# EAGLE design A607B (EAGLE 6.6.0)
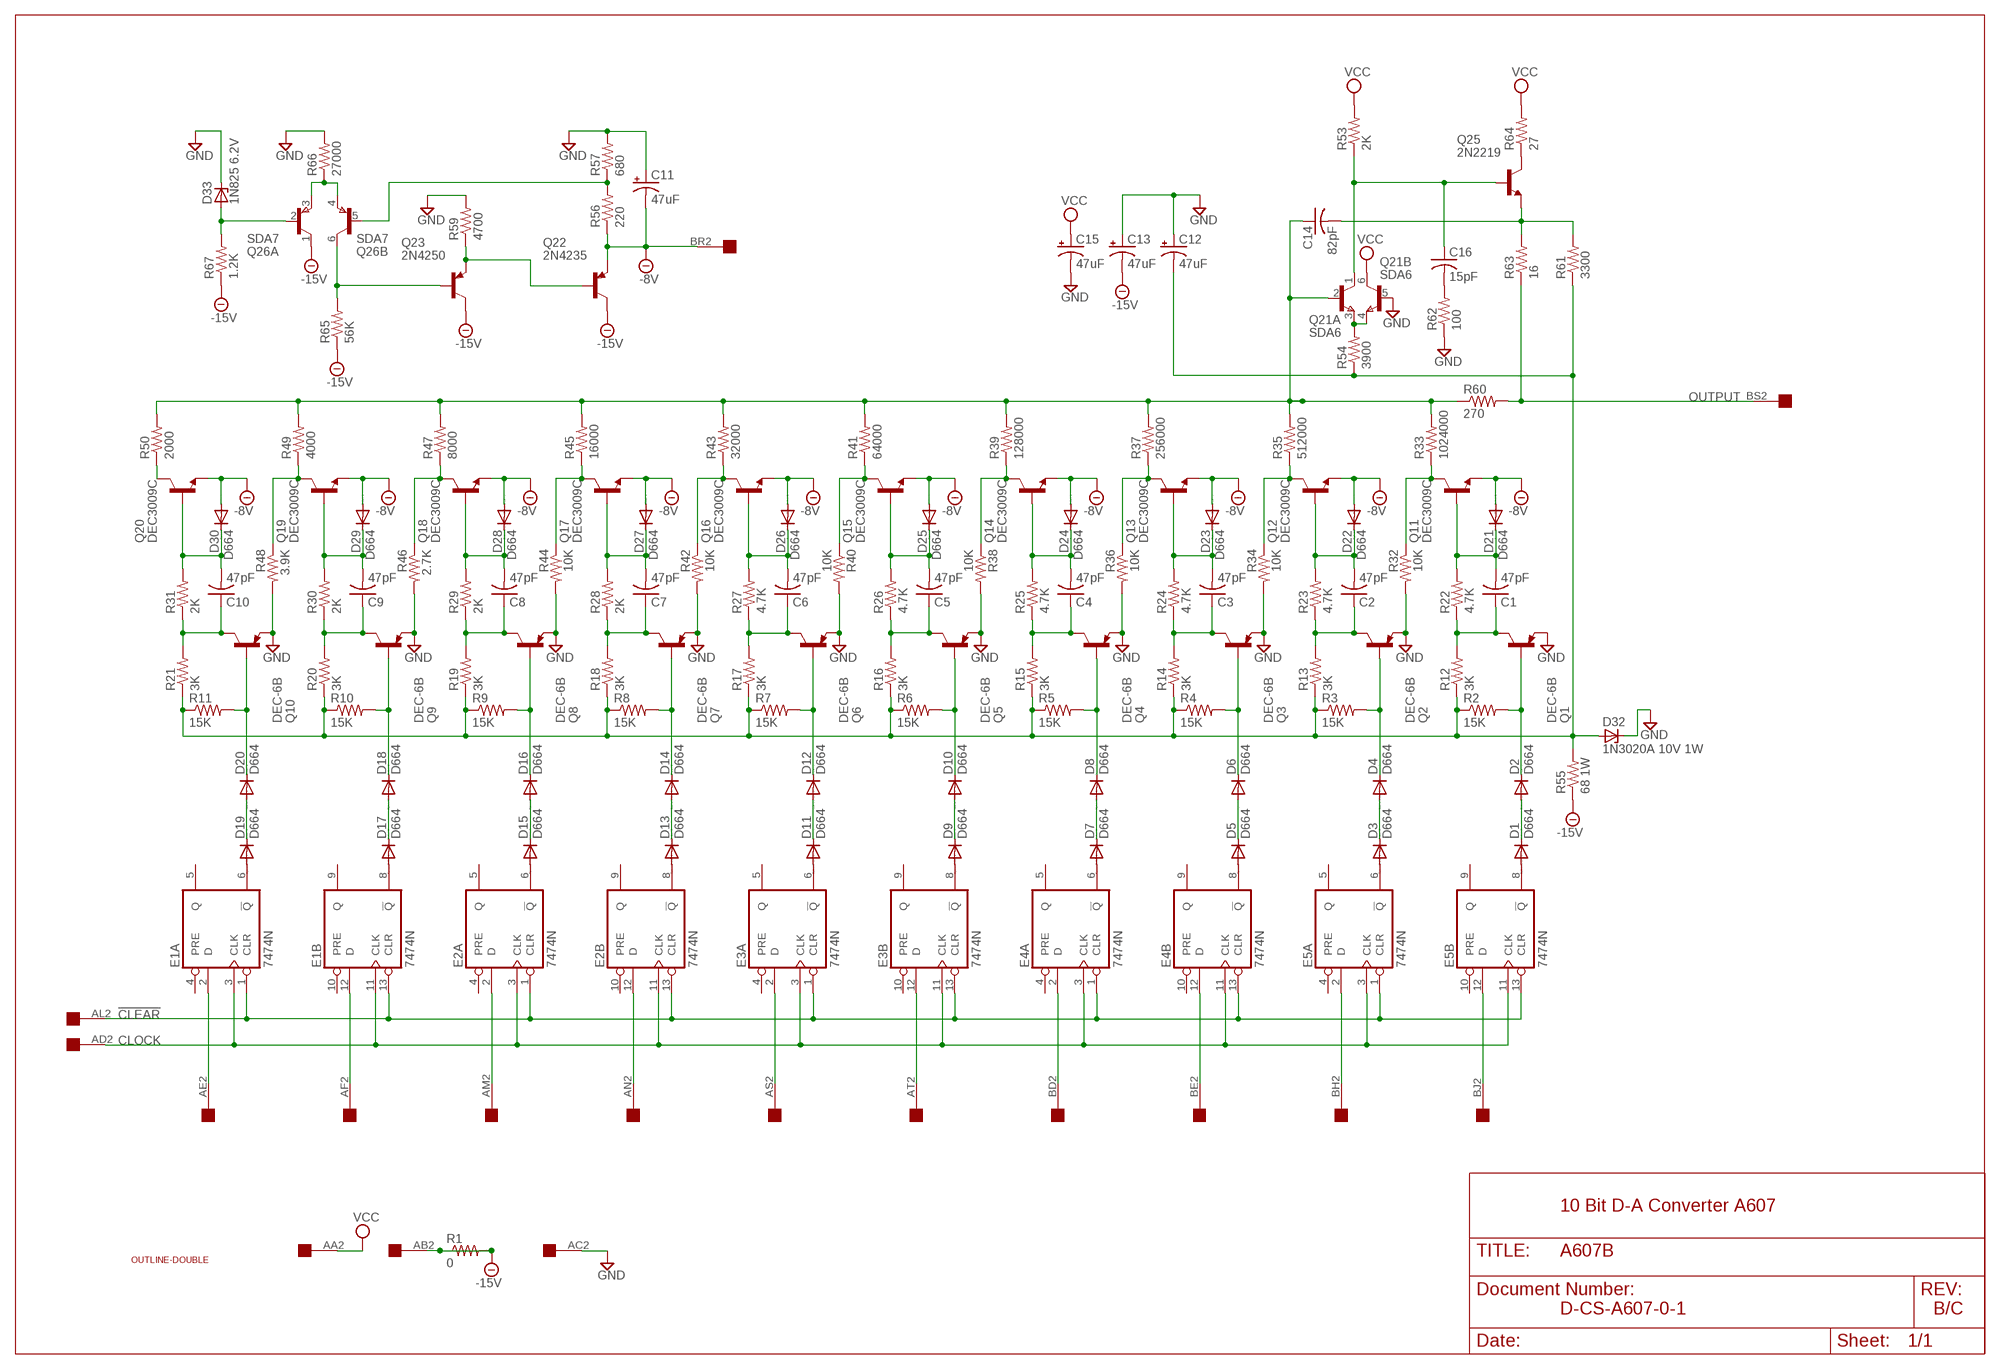
[diagram p0: schematic, sheet 1]

## Parts
C1  47pF  C-US075-032X103  [C075-032X103]
C2  47pF  C-US075-032X103  [C075-032X103]
C3  47pF  C-US075-032X103  [C075-032X103]
C4  47pF  C-US075-032X103  [C075-032X103]
C5  47pF  C-US075-032X103  [C075-032X103]
C6  47pF  C-US075-032X103  [C075-032X103]
C7  47pF  C-US075-032X103  [C075-032X103]
C8  47pF  C-US075-032X103  [C075-032X103]
C9  47pF  C-US075-032X103  [C075-032X103]
C10  47pF  C-US075-032X103  [C075-032X103]
C11  47uF  CPOL-USE25-9AXIAL  [E25-9]
C12  47uF  CPOL-USE25-9AXIAL  [E25-9]
C13  47uF  CPOL-USE25-9AXIAL  [E25-9]
C14  82pF  C-US050-025X075  [C050-025X075]
C15  47uF  CPOL-USE25-9AXIAL  [E25-9]
C16  15pF  C-US050-025X075  [C050-025X075]
D1  D664  DIODE-DO35-10  [DO35-10]
D2  D664  DIODE-DO35-10  [DO35-10]
D3  D664  DIODE-DO35-10  [DO35-10]
D4  D664  DIODE-DO35-10  [DO35-10]
D5  D664  DIODE-DO35-10  [DO35-10]
D6  D664  DIODE-DO35-10  [DO35-10]
D7  D664  DIODE-DO35-10  [DO35-10]
D8  D664  DIODE-DO35-10  [DO35-10]
D9  D664  DIODE-DO35-10  [DO35-10]
D10  D664  DIODE-DO35-10  [DO35-10]
D11  D664  DIODE-DO35-10  [DO35-10]
D12  D664  DIODE-DO35-10  [DO35-10]
D13  D664  DIODE-DO35-10  [DO35-10]
D14  D664  DIODE-DO35-10  [DO35-10]
D15  D664  DIODE-DO35-10  [DO35-10]
D16  D664  DIODE-DO35-10  [DO35-10]
D17  D664  DIODE-DO35-10  [DO35-10]
D18  D664  DIODE-DO35-10  [DO35-10]
D19  D664  DIODE-DO35-10  [DO35-10]
D20  D664  DIODE-DO35-10  [DO35-10]
D21  D664  DIODE-DO35-10  [DO35-10]
D22  D664  DIODE-DO35-10  [DO35-10]
D23  D664  DIODE-DO35-10  [DO35-10]
D24  D664  DIODE-DO35-10  [DO35-10]
D25  D664  DIODE-DO35-10  [DO35-10]
D26  D664  DIODE-DO35-10  [DO35-10]
D27  D664  DIODE-DO35-10  [DO35-10]
D28  D664  DIODE-DO35-10  [DO35-10]
D29  D664  DIODE-DO35-10  [DO35-10]
D30  D664  DIODE-DO35-10  [DO35-10]
D32  1N3020A 10V 1W  ZENER-DIODEDO13M  [DO13M]
D33  1N825 6.2V  ZENER-DIODEDO35Z10  [DO35Z10]
E1  7474N  74S74N  [DIL14]
E2  7474N  74S74N  [DIL14]
E3  7474N  74S74N  [DIL14]
E4  7474N  74S74N  [DIL14]
E5  7474N  74S74N  [DIL14]
Q1  DEC-6B  -PNP-TO5  [TO5]
Q2  DEC-6B  -PNP-TO5  [TO5]
Q3  DEC-6B  -PNP-TO5  [TO5]
Q4  DEC-6B  -PNP-TO5  [TO5]
Q5  DEC-6B  -PNP-TO5  [TO5]
Q6  DEC-6B  -PNP-TO5  [TO5]
Q7  DEC-6B  -PNP-TO5  [TO5]
Q8  DEC-6B  -PNP-TO5  [TO5]
Q9  DEC-6B  -PNP-TO5  [TO5]
Q10  DEC-6B  -PNP-TO5  [TO5]
Q11  DEC3009C  -NPN-TO5  [TO5]
Q12  DEC3009C  -NPN-TO5  [TO5]
Q13  DEC3009C  -NPN-TO5  [TO5]
Q14  DEC3009C  -NPN-TO5  [TO5]
Q15  DEC3009C  -NPN-TO5  [TO5]
Q16  DEC3009C  -NPN-TO5  [TO5]
Q17  DEC3009C  -NPN-TO5  [TO5]
Q18  DEC3009C  -NPN-TO5  [TO5]
Q19  DEC3009C  -NPN-TO5  [TO5]
Q20  DEC3009C  -NPN-TO5  [TO5]
Q21  SDA6  MAT-02H  [TO78]
Q22  2N4235  -PNP-TO5  [TO5]
Q23  2N4250  -PNP-TO5  [TO5]
Q25  2N2219  -NPN-TO5  [TO5]
Q26  SDA7  MAT-03H  [TO78]
R1  0  R-US_0818/25  [0818/25]
R2  15K  R-US_0207/10  [0207/10]
R3  15K  R-US_0207/10  [0207/10]
R4  15K  R-US_0207/10  [0207/10]
R5  15K  R-US_0207/10  [0207/10]
R6  15K  R-US_0207/10  [0207/10]
R7  15K  R-US_0207/10  [0207/10]
R8  15K  R-US_0207/10  [0207/10]
R9  15K  R-US_0207/10  [0207/10]
R10  15K  R-US_0207/10  [0207/10]
R11  15K  R-US_0207/10  [0207/10]
R12  3K  R-US_0207/10  [0207/10]
R13  3K  R-US_0207/10  [0207/10]
R14  3K  R-US_0207/10  [0207/10]
R15  3K  R-US_0207/10  [0207/10]
R16  3K  R-US_0207/10  [0207/10]
R17  3K  R-US_0207/10  [0207/10]
R18  3K  R-US_0207/10  [0207/10]
R19  3K  R-US_0207/10  [0207/10]
R20  3K  R-US_0207/10  [0207/10]
R21  3K  R-US_0207/10  [0207/10]
R22  4.7K  R-US_0207/10  [0207/10]
R23  4.7K  R-US_0207/10  [0207/10]
R24  4.7K  R-US_0207/10  [0207/10]
R25  4.7K  R-US_0207/10  [0207/10]
R26  4.7K  R-US_0207/10  [0207/10]
R27  4.7K  R-US_0207/10  [0207/10]
R28  2K  R-US_0207/10  [0207/10]
R29  2K  R-US_0207/10  [0207/10]
R30  2K  R-US_0207/10  [0207/10]
R31  2K  R-US_0207/10  [0207/10]
R32  10K  R-US_0207/10  [0207/10]
R33  1024000  R-US_0414/20  [0414/20]
R34  10K  R-US_0207/10  [0207/10]
R35  512000  R-US_0414/20  [0414/20]
R36  10K  R-US_0207/10  [0207/10]
R37  256000  R-US_0207/15  [0207/15]
R38  10K  R-US_0207/10  [0207/10]
R39  128000  R-US_0207/15  [0207/15]
R40  10K  R-US_0207/10  [0207/10]
R41  64000  R-US_0207/15  [0207/15]
R42  10K  R-US_0207/10  [0207/10]
R43  32000  R-US_0207/15  [0207/15]
R44  10K  R-US_0207/10  [0207/10]
R45  16000  R-US_0207/15  [0207/15]
R46  2.7K  R-US_0207/10  [0207/10]
R47  8000  R-US_0207/15  [0207/15]
R48  3.9K  R-US_0207/10  [0207/10]
R49  4000  R-US_0207/15  [0207/15]
R50  2000  R-US_0207/15  [0207/15]
R53  2K  R-US_0207/10  [0207/10]
R54  3900  R-US_0207/10  [0207/10]
R55  68 1W  R-US_0818/25  [0818/25]
R56  220  R-US_0207/10  [0207/10]
R57  680  R-US_0207/10  [0207/10]
R59  4700  R-US_0207/10  [0207/10]
R60  270  R-US_0207/10  [0207/10]
R61  3300  R-US_0207/10  [0207/10]
R62  100  R-US_0207/10  [0207/10]
R63  16  R-US_0207/10  [0207/10]
R64  27  R-US_0207/10  [0207/10]
R65  56K  R-US_0207/10  [0207/10]
R66  27000  R-US_0207/10  [0207/10]
R67  1.2K  R-US_0207/10  [0207/10]
U$1  OUTLINE-DOUBLE  [DOUBLE]
U$2  DOUBLE  [EDGE-CON4]

## Nets
!CLEAR: E1.1(A:CLR) E1.13(B:CLR) E2.1(A:CLR) E2.13(B:CLR) E3.1(A:CLR) E3.13(B:CLR) E4.1(A:CLR) E4.13(B:CLR) E5.1(A:CLR) E5.13(B:CLR) U$2.AL2
-8V [supply]: C11.- D21.A D22.A D23.A D24.A D25.A D26.A D27.A D28.A D29.A D30.A Q11.1(E) Q12.1(E) Q13.1(E) Q14.1(E) Q15.1(E) Q16.1(E) Q17.1(E) Q18.1(E) Q19.1(E) Q20.1(E) Q22.1(E) R56.1 U$2.BR2
-15V: C13.- Q22.3(C) Q23.3(C) Q26.1(A:C) R1.1 R1.2 R55.1 R65.1 R67.1 U$2.AB2
CLOCK: E1.3(A:CLK) E1.11(B:CLK) E2.3(A:CLK) E2.11(B:CLK) E3.3(A:CLK) E3.11(B:CLK) E4.3(A:CLK) E4.11(B:CLK) E5.3(A:CLK) E5.11(B:CLK) U$2.AD2
GND [supply]: C11.+ C12.+ C13.+ C15.- D32.C D33.C Q1.1(E) Q2.1(E) Q3.1(E) Q4.1(E) Q5.1(E) Q6.1(E) Q7.1(E) Q8.1(E) Q9.1(E) Q10.1(E) Q21.5(B:B) R32.2 R34.2 R36.2 R38.2 R40.2 R42.2 R44.2 R46.2 R48.2 R57.2 R59.2 R62.1 R66.2 U$2.AC2
N$1: E1.2(A:D) U$2.AE2
N$2: E1.12(B:D) U$2.AF2
N$3: E2.2(A:D) U$2.AM2
N$4: E2.12(B:D) U$2.AN2
N$5: E3.2(A:D) U$2.AS2
N$6: E3.12(B:D) U$2.AT2
N$7: E4.2(A:D) U$2.BD2
N$8: E4.12(B:D) U$2.BE2
N$9: E5.2(A:D) U$2.BH2
N$10: E5.12(B:D) U$2.BJ2
N$11: D1.A E5.8(B:!Q)
N$12: D3.A E5.6(A:!Q)
N$13: D5.A E4.8(B:!Q)
N$14: D7.A E4.6(A:!Q)
N$15: D9.A E3.8(B:!Q)
N$16: D11.A E3.6(A:!Q)
N$17: D13.A E2.8(B:!Q)
N$18: D15.A E2.6(A:!Q)
N$19: D17.A E1.8(B:!Q)
N$20: D19.A E1.6(A:!Q)
N$21: D19.C D20.A
N$22: D17.C D18.A
N$23: D15.C D16.A
N$24: D13.C D14.A
N$25: D11.C D12.A
N$26: D9.C D10.A
N$27: D7.C D8.A
N$28: D5.C D6.A
N$29: D3.C D4.A
N$30: D1.C D2.A
N$31: D20.C Q10.2(B) R11.2
N$32: D18.C Q9.2(B) R10.2
N$33: D16.C Q8.2(B) R9.2
N$34: D14.C Q7.2(B) R8.2
N$35: D12.C Q6.2(B) R7.2
N$36: D10.C Q5.2(B) R6.2
N$37: D8.C Q4.2(B) R5.2
N$38: D6.C Q3.2(B) R4.2
N$39: D4.C Q2.2(B) R3.2
N$40: D2.C Q1.2(B) R2.2
N$41 [supply]: C12.- D32.A R2.1 R3.1 R4.1 R5.1 R6.1 R7.1 R8.1 R9.1 R10.1 R11.1 R12.1 R13.1 R14.1 R15.1 R16.1 R17.1 R18.1 R19.1 R20.1 R21.1 R54.1 R55.2 R61.1
N$42: Q23.2(B) Q26.6(B:C) R65.2
N$43: Q26.3(A:E) Q26.4(B:E) R66.1
N$44: Q22.2(B) Q23.1(E) R59.1
N$45: Q26.5(B:B) R56.2 R57.1
N$46: D33.A Q26.2(A:B) R67.2
N$51: C1.1 Q1.3(C) R12.2 R22.1
N$52: C2.1 Q2.3(C) R13.2 R23.1
N$53: C3.1 Q3.3(C) R14.2 R24.1
N$54: C4.1 Q4.3(C) R15.2 R25.1
N$55: C6.1 Q6.3(C) R17.2 R27.1
N$56: C7.1 Q7.3(C) R18.2 R28.1
N$57: C8.1 Q8.3(C) R19.2 R29.1
N$58: C9.1 Q9.3(C) R20.2 R30.1
N$59: C10.1 Q10.3(C) R21.2 R31.1
N$60: C5.1 Q5.3(C) R16.2 R26.1
N$61: C9.2 D29.C Q19.2(B) R30.2
N$62: C1.2 D21.C Q11.2(B) R22.2
N$63: C2.2 D22.C Q12.2(B) R23.2
N$64: C3.2 D23.C Q13.2(B) R24.2
N$65: C4.2 D24.C Q14.2(B) R25.2
N$66: C5.2 D25.C Q15.2(B) R26.2
N$67: C6.2 D26.C Q16.2(B) R27.2
N$68: C7.2 D27.C Q17.2(B) R28.2
N$69: C8.2 D28.C Q18.2(B) R29.2
N$70: C10.2 D30.C Q20.2(B) R31.2
N$71: Q20.3(C) R50.1
N$72: Q19.3(C) R48.1 R49.1
N$73: Q18.3(C) R46.1 R47.1
N$74: Q17.3(C) R44.1 R45.1
N$75: Q11.3(C) R32.1 R33.1
N$76: Q12.3(C) R34.1 R35.1
N$77: Q13.3(C) R36.1 R37.1
N$78: Q14.3(C) R38.1 R39.1
N$79: Q15.3(C) R40.1 R41.1
N$80: Q16.3(C) R42.1 R43.1
N$81: Q25.3(C) R64.1
N$82: C16.1 Q21.1(A:C) Q25.2(B) R53.1
N$83: C14.1 Q21.2(A:B) R33.2 R35.2 R37.2 R39.2 R41.2 R43.2 R45.2 R47.2 R49.2 R50.2 R60.1
N$84: C14.2 Q25.1(E) R61.2 R63.2
N$85: Q21.3(A:E) Q21.4(B:E) R54.2
N$86: C16.2 R62.2
OUTPUT: R60.2 R63.1 U$2.BS2
VCC [supply]: C15.+ Q21.6(B:C) R53.2 R64.2 U$2.AA2
Unconnected: E1.4(A:PRE) E1.5(A:Q) E1.9(B:Q) E1.10(B:PRE) E2.4(A:PRE) E2.5(A:Q) E2.9(B:Q) E2.10(B:PRE) E3.4(A:PRE) E3.5(A:Q) E3.9(B:Q) E3.10(B:PRE) E4.4(A:PRE) E4.5(A:Q) E4.9(B:Q) E4.10(B:PRE) E5.4(A:PRE) E5.5(A:Q) E5.9(B:Q) E5.10(B:PRE) U$2.AA1 U$2.AB1 U$2.AC1 U$2.AD1 U$2.AE1 U$2.AF1 U$2.AH1 U$2.AH2 U$2.AJ1 U$2.AJ2 U$2.AK1 U$2.AK2 U$2.AL1 U$2.AM1 U$2.AN1 U$2.AP1 U$2.AP2 U$2.AR1 U$2.AR2 U$2.AS1 U$2.AT1 U$2.AU1 U$2.AU2 U$2.AV1 U$2.AV2 U$2.BA1 U$2.BA2 U$2.BB1 U$2.BB2 U$2.BC1 U$2.BC2 U$2.BD1 U$2.BE1 U$2.BF1 U$2.BF2 U$2.BH1 U$2.BJ1 U$2.BK1 U$2.BK2 U$2.BL1 U$2.BL2 U$2.BM1 U$2.BM2 U$2.BN1 U$2.BN2 U$2.BP1 U$2.BP2 U$2.BR1 U$2.BS1 U$2.BT1 U$2.BT2 U$2.BU1 U$2.BU2 U$2.BV1 U$2.BV2

## Notes on the sheet
- 10 Bit D-A Converter A607
- D-CS-A607-0-1 | B/C

## Power pins joined to a net without a drawn wire
GND: E1.7(P:GND) E2.7(P:GND) E3.7(P:GND) E4.7(P:GND) E5.7(P:GND)
VCC: E1.14(P:VCC) E2.14(P:VCC) E3.14(P:VCC) E4.14(P:VCC) E5.14(P:VCC)

## Library data of the parts
C1-C10 C14 C16 = rcl:C-US: CAPACITOR, American symbol
C11-C13 C15 = rcl:CPOL-US: POLARIZED CAPACITOR, American symbol
D1-D30 = diode:DIODE-: DIODE
D32 D33 = diode:ZENER-DIODE: Z-Diode
E1-E5 = 74xx-us:74*74: Dual D type positive edge triggered FLIP FLOP, preset and clear
Q1-Q10 Q22 Q23 = transistor:*-PNP-: PNP Transistror
Q11-Q20 Q25 = transistor:*-NPN-: NPN Transistror BF959 corrected 2008.03.06
Q21 = linear:MAT-02H: Dual TRANSISTOR
Q26 = linear:MAT-03H: Dual TRANSISTOR
R1 R55 = dec-con:R-US_0818/25: One inch resistor
R2-R32 R34 R36-R50 R53 R54 R56 R57 R59-R67 = rcl:R-US_: RESISTOR, American symbol
R33 R35 = dec-con:R-US_0414/20: 0.8" Resistor
U$1 = dec-con:OUTLINE-*: Board outlines for DEC boards.
U$2 = dec-con:DOUBLE: Double-Height DEC board

## Net classes
1 supply: width 0.813 mm

## Board
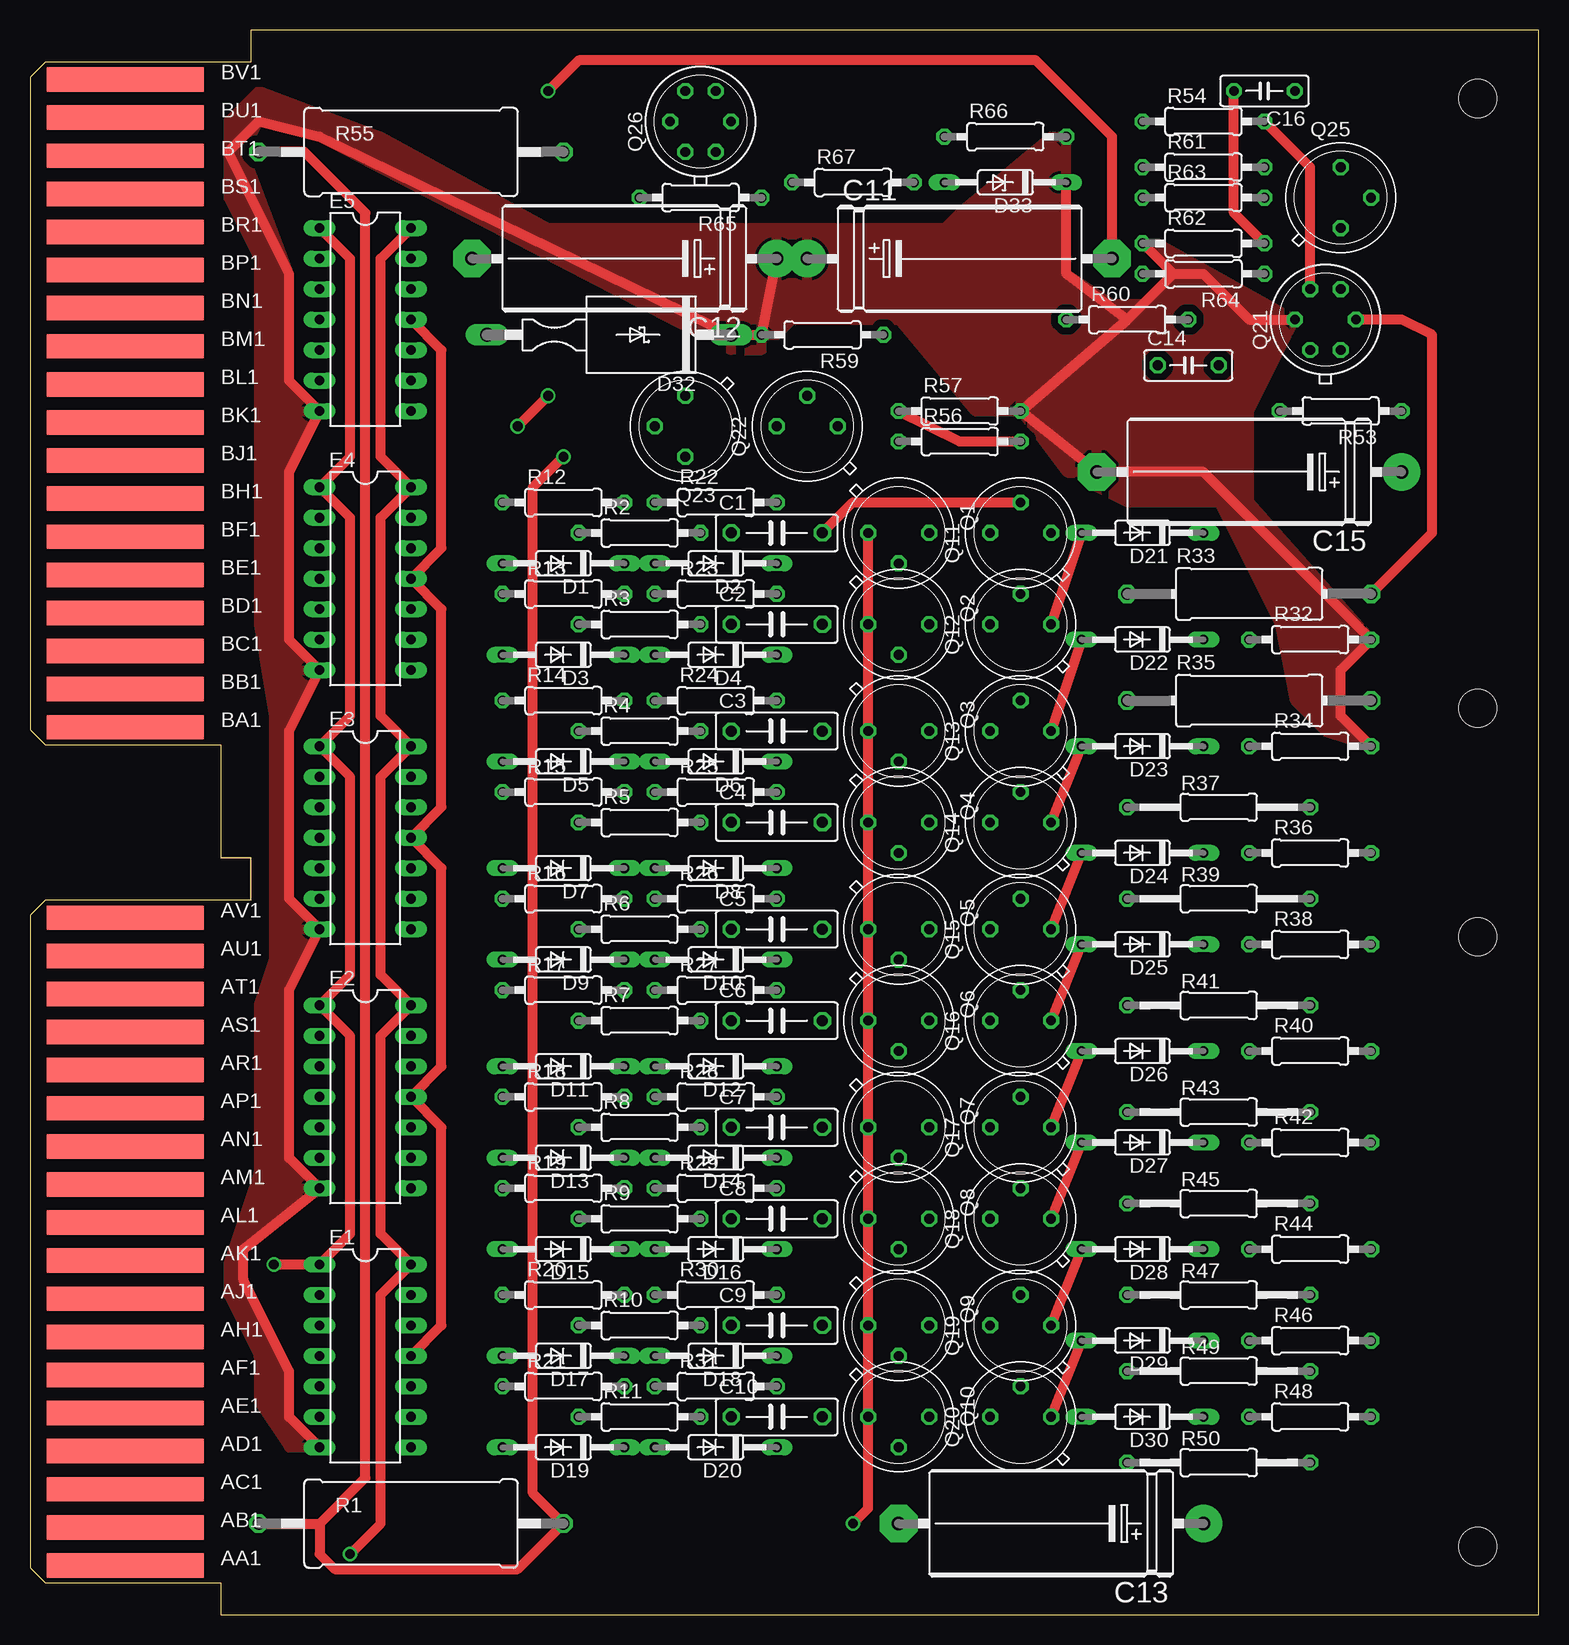
[diagram p1: board, top side]
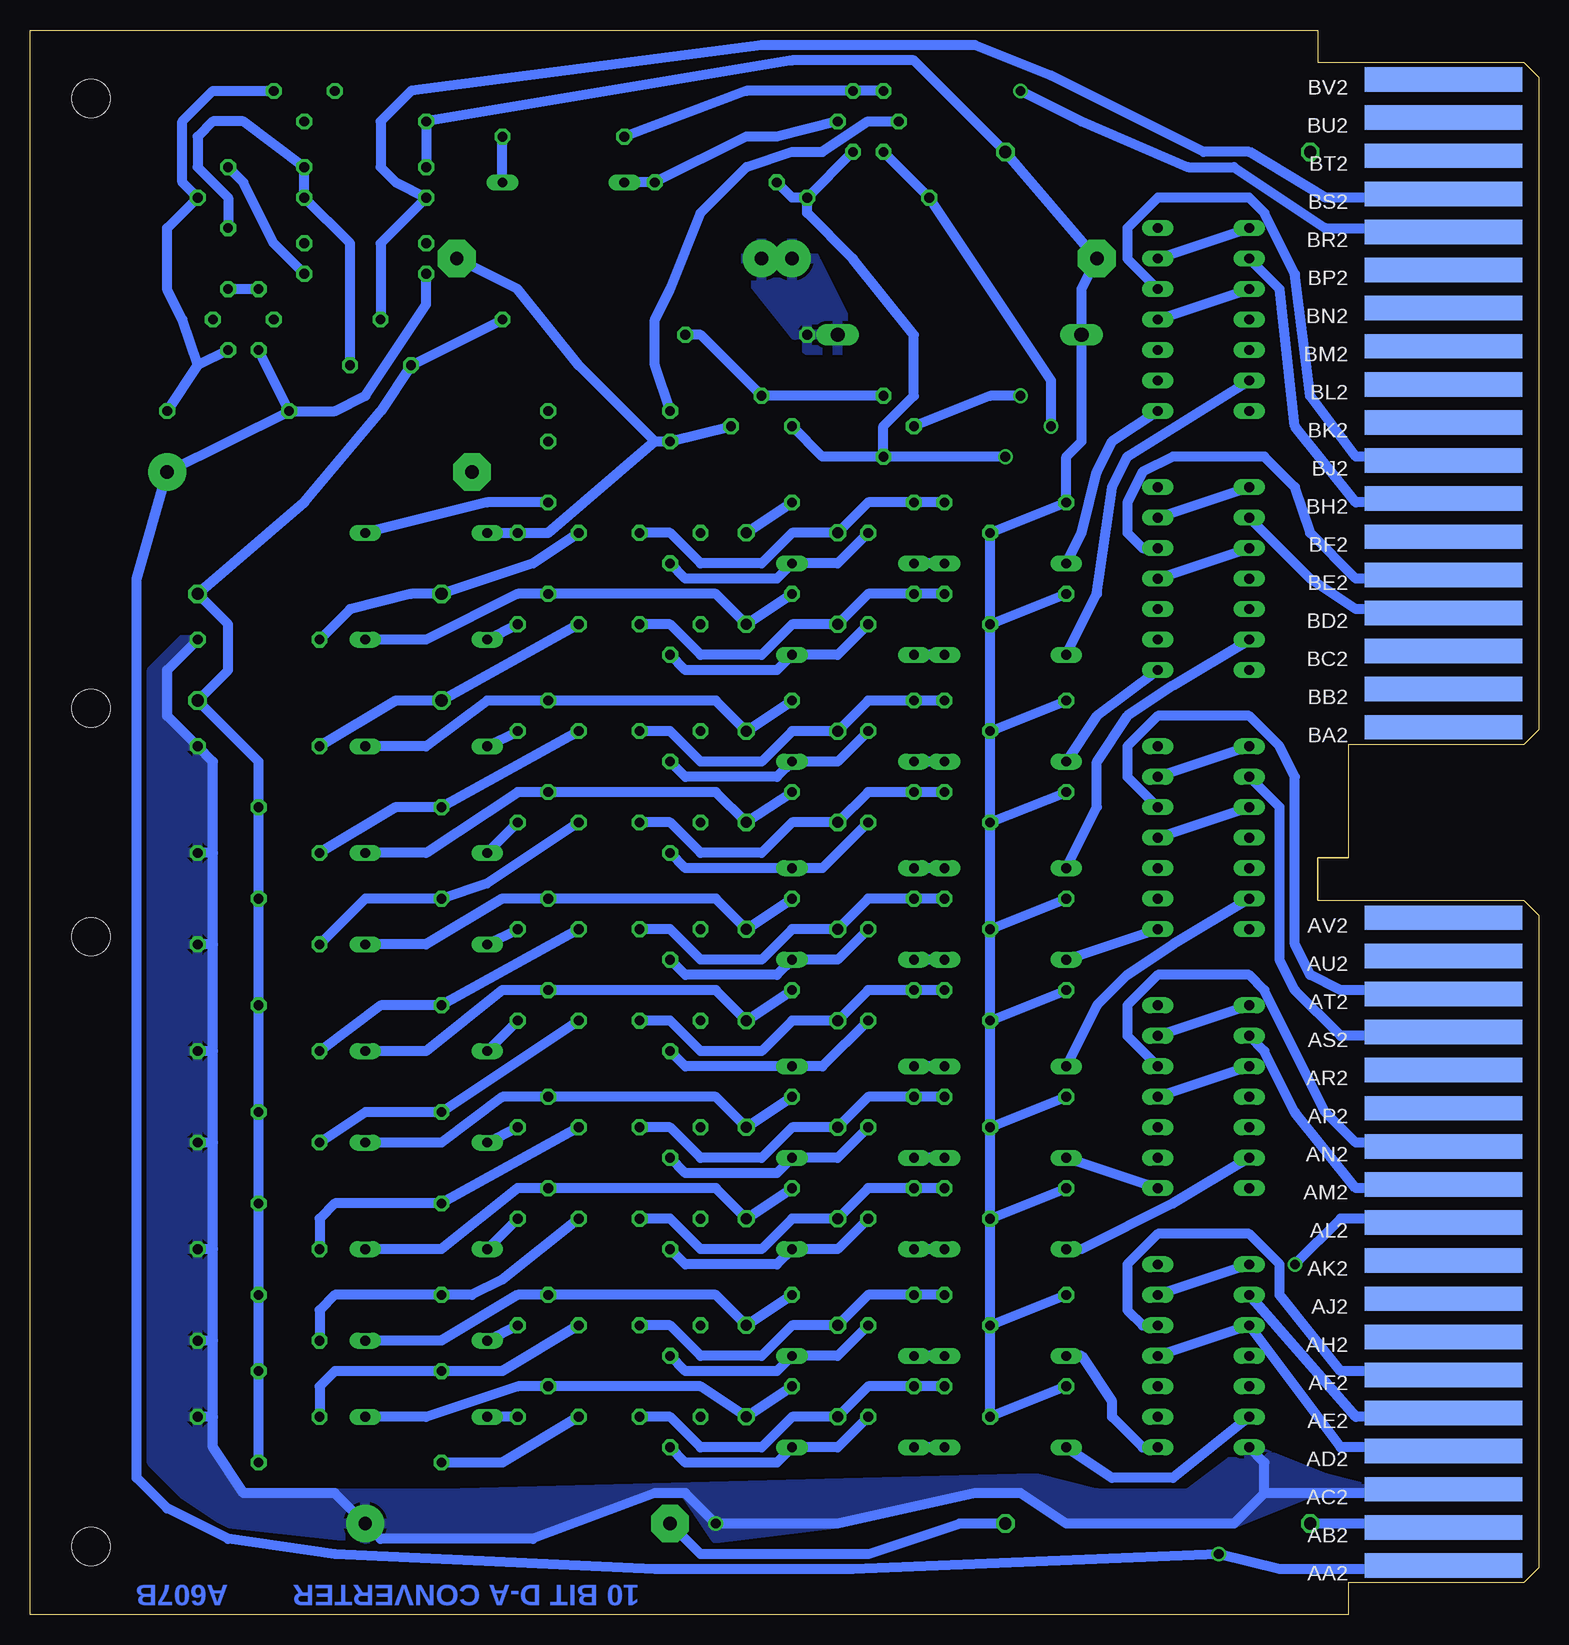
[diagram p2: board, bottom side, seen from below]

Size 125.73 x 132.08 mm. Coordinates in mm from the lower left corner, seen from the top.
Copper layers (1+2+16): Top 0.035mm / dielectric 1.5mm / layer 2 0.035mm / dielectric 0.15mm / Bottom 0.035mm
Design rules "16mils": minimum track width 16mil, minimum drill 32mil, track to track 15mil, track to pad 10mil, pad to pad 10mil, via to via 10mil, smd to smd 10mil, copper to edge 13mil, drill to drill 10mil, minimum pad ring 10mil, minimum via ring 8mil, stop-mask expansion 0mil, vias tented up to drill 0mil, thermal gap 10mil

### Footprints (pad centres in the part's own frame; a part is rotated, then mirrored left to right if it is on the bottom)
C075-032X103 = drill 0.914 octagon: 1 -3.81,0; 2 3.81,0
E25-9 = drill 1.118 pad 3.15: + -12.7,0 | drill 1.118 pad 3.15 octagon: - 12.7,0
C050-025X075 = drill 0.813 octagon: 1 -2.54,0; 2 2.54,0
DO35-10 = drill 0.813 long: A 5.08,0; C -5.08,0
DO13M = drill 1.194 long: A 10.16,0; C -10.16,0
DO35Z10 = drill 0.813 long: A 5.08,0; C -5.08,0
DIL14 = drill 0.813 long: 1 -7.62,-3.81; 2 -5.08,-3.81; 3 -2.54,-3.81; 4 0,-3.81; 5 2.54,-3.81; 6 5.08,-3.81; 7 7.62,-3.81; 8 7.62,3.81; 9 5.08,3.81; 10 2.54,3.81; 11 0,3.81; 12 -2.54,3.81; 13 -5.08,3.81; 14 -7.62,3.81
TO5 = drill 0.813 octagon: 1 0,-2.54; 2 2.54,0; 3 0,2.54
TO78 = drill 0.813 octagon: 1 -2.54,-1.27; 2 0,-2.54; 3 2.54,-1.27; 4 2.54,1.27; 5 0,2.54; 6 -2.54,1.27
0818/25 = drill 1.016 octagon: 1 -12.7,0; 2 12.7,0
0207/10 = drill 0.813 octagon: 1 -5.08,0; 2 5.08,0
0414/20 = drill 1.016 octagon: 1 -10.16,0; 2 10.16,0
0207/15 = drill 0.813 octagon: 1 -7.62,0; 2 7.62,0
DOUBLE = hole 3.175: 120.65,56.515; 120.65,5.715; 120.65,75.565; 120.65,126.365
EDGE-CON4 = smd 13.106 x 2.032: AA1 7.938,4.128; AB1 7.938,7.303; AC1 7.938,10.477; AD1 7.938,13.652; AE1 7.938,16.828; AF1 7.938,20.003; AH1 7.938,23.177; AJ1 7.938,26.352; AK1 7.938,29.527; AL1 7.938,32.703; AM1 7.938,35.877; AN1 7.938,39.053; AP1 7.938,42.227; AR1 7.938,45.403; AS1 7.938,48.578; AT1 7.938,51.752; AU1 7.938,54.928; AV1 7.938,58.102; BA1 7.938,73.978; BB1 7.938,77.153; BC1 7.938,80.328; BD1 7.938,83.502; BE1 7.938,86.677; BF1 7.938,89.853; BH1 7.938,93.028; BJ1 7.938,96.203; BK1 7.938,99.377; BL1 7.938,102.552; BM1 7.938,105.728; BN1 7.938,108.903; BP1 7.938,112.078; BR1 7.938,115.252; BS1 7.938,118.427; BT1 7.938,121.603; BU1 7.938,124.778; BV1 7.938,127.953 | smd 13.106 x 2.032 bottom: AA2 7.938,4.128; AB2 7.938,7.303; AC2 7.938,10.477; AD2 7.938,13.652; AE2 7.938,16.828; AF2 7.938,20.003; AH2 7.938,23.177; AJ2 7.938,26.352; AK2 7.938,29.527; AL2 7.938,32.703; AM2 7.938,35.877; AN2 7.938,39.053; AP2 7.938,42.227; AR2 7.938,45.403; AS2 7.938,48.578; AT2 7.938,51.752; AU2 7.938,54.928; AV2 7.938,58.102; BA2 7.938,73.978; BB2 7.938,77.153; BC2 7.938,80.328; BD2 7.938,83.502; BE2 7.938,86.677; BF2 7.938,89.853; BH2 7.938,93.028; BJ2 7.938,96.203; BK2 7.938,99.377; BL2 7.938,102.552; BM2 7.938,105.728; BN2 7.938,108.903; BP2 7.938,112.078; BR2 7.938,115.252; BS2 7.938,118.427; BT2 7.938,121.603; BU2 7.938,124.778; BV2 7.938,127.953

### Placement (x,y rotation side)
C1  62.23,90.17 0 top
C2  62.23,82.55 0 top
C3  62.23,73.66 0 top
C4  62.23,66.04 0 top
C5  62.23,57.15 0 top
C6  62.23,49.53 0 top
C7  62.23,40.64 0 top
C8  62.23,33.02 0 top
C9  62.23,24.13 0 top
C10  62.23,16.51 0 top
C11  77.47,113.03 0 top
C12  49.53,113.03 180 top
C13  85.09,7.62 180 top
C14  96.52,104.14 0 top
C15  101.6,95.25 180 top
C16  102.87,127 180 top
D1  44.45,87.63 180 top
D2  57.15,87.63 180 top
D3  44.45,80.01 180 top
D4  57.15,80.01 180 top
D5  44.45,71.12 180 top
D6  57.15,71.12 180 top
D7  44.45,62.23 180 top
D8  57.15,62.23 180 top
D9  44.45,54.61 180 top
D10  57.15,54.61 180 top
D11  44.45,45.72 180 top
D12  57.15,45.72 180 top
D13  44.45,38.1 180 top
D14  57.15,38.1 180 top
D15  44.45,30.48 180 top
D16  57.15,30.48 180 top
D17  44.45,21.59 180 top
D18  57.15,21.59 180 top
D19  44.45,13.97 180 top
D20  57.15,13.97 180 top
D21  92.71,90.17 180 top
D22  92.71,81.28 180 top
D23  92.71,72.39 180 top
D24  92.71,63.5 180 top
D25  92.71,55.88 180 top
D26  92.71,46.99 180 top
D27  92.71,39.37 180 top
D28  92.71,30.48 180 top
D29  92.71,22.86 180 top
D30  92.71,16.51 180 top
D32  48.26,106.68 180 top
D33  81.28,119.38 180 top
E1  27.94,21.59 270 top
E2  27.94,43.18 270 top
E3  27.94,64.77 270 top
E4  27.94,86.36 270 top
E5  27.94,107.95 270 top
Q1  72.39,90.17 270 top
Q2  72.39,82.55 270 top
Q3  72.39,73.66 270 top
Q4  72.39,66.04 270 top
Q5  72.39,57.15 270 top
Q6  72.39,49.53 270 top
Q7  72.39,40.64 270 top
Q8  72.39,33.02 270 top
Q9  72.39,24.13 270 top
Q10  72.39,16.51 270 top
Q11  82.55,90.17 90 top
Q12  82.55,82.55 90 top
Q13  82.55,73.66 90 top
Q14  82.55,66.04 90 top
Q15  82.55,57.15 90 top
Q16  82.55,49.53 90 top
Q17  82.55,40.64 90 top
Q18  82.55,33.02 90 top
Q19  82.55,24.13 90 top
Q20  82.55,16.51 90 top
Q21  107.95,107.95 90 top
Q22  64.77,99.06 90 top
Q23  54.61,99.06 180 top
Q25  109.22,118.11 0 top
Q26  55.88,124.46 90 top
R1  31.75,7.62 0 top
R2  50.8,90.17 0 top
R3  50.8,82.55 0 top
R4  50.8,73.66 0 top
R5  50.8,66.04 0 top
R6  50.8,57.15 0 top
R7  50.8,49.53 0 top
R8  50.8,40.64 0 top
R9  50.8,33.02 0 top
R10  50.8,24.13 0 top
R11  50.8,16.51 0 top
R12  44.45,92.71 0 top
R13  44.45,85.09 0 top
R14  44.45,76.2 0 top
R15  44.45,68.58 0 top
R16  44.45,59.69 0 top
R17  44.45,52.07 0 top
R18  44.45,43.18 0 top
R19  44.45,35.56 0 top
R20  44.45,26.67 0 top
R21  44.45,19.05 0 top
R22  57.15,92.71 0 top
R23  57.15,85.09 0 top
R24  57.15,76.2 0 top
R25  57.15,68.58 0 top
R26  57.15,59.69 0 top
R27  57.15,52.07 0 top
R28  57.15,43.18 0 top
R29  57.15,35.56 0 top
R30  57.15,26.67 0 top
R31  57.15,19.05 0 top
R32  106.68,81.28 0 top
R33  101.6,85.09 0 top
R34  106.68,72.39 0 top
R35  101.6,76.2 0 top
R36  106.68,63.5 0 top
R37  99.06,67.31 0 top
R38  106.68,55.88 0 top
R39  99.06,59.69 0 top
R40  106.68,46.99 0 top
R41  99.06,50.8 0 top
R42  106.68,39.37 0 top
R43  99.06,41.91 0 top
R44  106.68,30.48 0 top
R45  99.06,34.29 0 top
R46  106.68,22.86 0 top
R47  99.06,26.67 0 top
R48  106.68,16.51 0 top
R49  99.06,20.32 0 top
R50  99.06,12.7 0 top
R53  109.22,100.33 180 top
R54  97.79,124.46 0 top
R55  31.75,121.92 0 top
R56  77.47,97.79 0 top
R57  77.47,100.33 0 top
R59  66.04,106.68 180 top
R60  91.44,107.95 0 top
R61  97.79,120.65 0 top
R62  97.79,114.3 0 top
R63  97.79,118.11 0 top
R64  97.79,111.76 180 top
R65  55.88,118.11 180 top
R66  81.28,123.19 0 top
R67  68.58,119.38 0 top
U$1  0,0 0 top
U$2  0,0 0 top

### Tracks (layer width: path | path; a pad name or v marks a point on that pad's centre or on a via)
!CLEAR  (via drill 0.81)
  Top 0.813: v20.32,29.21 E1.1 26.67,31.75 26.67,48.26 E2.1 26.67,53.34 26.67,69.85 E3.1 26.67,74.93 26.67,91.44 E4.1 26.67,96.52 26.67,113.03 E5.1
  Bottom 0.813: U$2.AL2 8.26,33.02 16.51,33.02 v20.32,29.21 | E3.1 E3.13 | E5.1 E5.13 | E2.1 E2.13 | E1.1 E1.13 | E4.1 E4.13
-8V  (via drill 0.81)
  Top 0.813: Q12.1 D21.A | Q13.1 D22.A | Q14.1 D23.A | Q15.1 D24.A | Q16.1 D25.A | Q17.1 D26.A | Q18.1 D27.A | Q19.1 D28.A | Q20.1 D29.A | v43.18,127 45.72,129.54 83.82,129.54 90.17,123.19 C11.-
  Bottom 0.813: Q22.1 R56.1 73.66,97.79 | 73.66,97.79 82.55,90.17 Q11.1 D21.A | C11.- 85.09,110.49 80.01,104.14 73.66,97.79 | U$2.BR2 8.89,115.57 17.78,115.57 25.4,120.65 29.21,120.65 38.1,124.46 v43.18,127 | D22.A Q12.1 | D23.A Q13.1 | D24.A Q14.1 | D25.A Q15.1 | D26.A Q16.1 | Q20.1 D30.A | D29.A Q19.1 | D27.A Q17.1 | D28.A Q18.1
-15V  (via drill 0.81)
  Top 0.813: R1.1 24.13,7.62 | 24.13,7.62 27.94,11.43 27.94,116.84 22.86,121.92 R55.1 | v44.45,96.52 41.91,93.98 41.91,10.16 R1.2 40.64,3.81 25.4,3.81 24.13,5.08 24.13,7.62
  Bottom 0.813: U$2.AB2 8.26,7.62 R1.1 | v44.45,96.52 Q23.3 | Q22.3 59.69,96.52 Q23.3 | R1.2 48.26,7.62 55.88,5.08 69.85,5.08 C13.- | R65.1 Q26.1 | R65.1 62.23,118.11 R67.1 | Q23.3 54.61,99.06 52.07,101.6 52.07,106.68 57.15,113.03 60.96,116.84 R65.1
CLOCK
  Top 0.813: E1.11 34.29,24.13 34.29,40.64 E2.11 34.29,45.72 34.29,62.23 E3.11 34.29,67.31 34.29,83.82 E4.11 34.29,88.9 34.29,105.41 E5.11
  Bottom 0.813: U$2.AD2 8.89,13.97 16.51,13.97 E1.3 E1.11 | E3.11 E3.3 | E2.11 E2.3 | E5.11 E5.3 | E4.11 E4.3
GND  (via drill 0.81)
  Top 0.813: E1.7 21.59,16.51 21.59,20.32 17.78,27.94 17.78,30.48 E2.7 21.59,38.1 21.59,52.07 E3.7 21.59,59.69 21.59,73.66 E4.7 21.59,81.28 21.59,95.25 E5.7 21.59,102.87 21.59,111.76 16.51,121.92 19.05,124.46 24.13,123.19 D32.C | v68.58,7.62 69.85,8.89 Q10.1 Q9.1 Q8.1 Q7.1 Q6.1 Q5.1 Q4.1 Q3.1 Q2.1 Q1.1 | D32.C R59.2 | R59.2 C12.+ | C12.+ C11.+ | R59.2 C12.+ | 95.25,111.76 R62.1 | D33.C 86.36,111.76 91.44,107.95 | 91.44,107.95 95.25,111.76 | 91.44,107.95 R57.2 C15.- 97.79,95.25 R32.2 109.22,78.74 109.22,74.93 R34.2 | Q21.5 101.6,107.95 97.79,111.76 95.25,111.76 | D32.C R59.2
  Bottom 0.813: U$2.AC2 8.26,10.16 22.86,10.16 | 22.86,10.16 25.4,7.62 39.37,7.62 43.18,10.16 46.99,10.16 58.42,7.62 v68.58,7.62 71.12,10.16 73.66,10.16 83.82,6.35 96.52,6.35 C13.+ 100.33,10.16 107.95,10.16 110.49,13.97 110.49,16.51 | E1.7 22.86,12.7 22.86,10.16 | D33.C R66.2 | R32.2 114.3,78.74 114.3,74.93 R34.2 110.49,71.12 110.49,63.5 | 110.49,63.5 R36.2 | 110.49,16.51 R48.2 | 110.49,16.51 110.49,22.86 | 110.49,22.86 110.49,30.48 | 110.49,30.48 110.49,39.37 | 110.49,39.37 110.49,46.99 | 110.49,46.99 110.49,55.88 | 110.49,55.88 110.49,63.5 | 110.49,55.88 R38.2 | 110.49,46.99 R40.2 | 110.49,39.37 R42.2 | 110.49,30.48 R44.2 | 110.49,22.86 R46.2
  pour Bottom: 24.13,13.97 17.78,11.43 12.7,10.16 19.05,10.16 25.4,7.62 39.37,7.62 43.18,10.16 46.99,10.16 58.42,7.62 68.58,6.35 71.12,10.16 73.66,10.16 83.82,6.35 97.79,6.35 109.22,7.62 113.03,10.16 115.57,12.7 115.57,78.74 113.03,81.28 111.76,81.28 114.3,78.74 114.3,74.93 110.49,71.12 110.49,13.97 107.95,10.16 91.44,10.16 41.91,11.43 36.83,10.16 29.21,10.16
  pour Bottom: 57.15,106.68 57.15,105.41 60.96,105.41 66.04,111.76 66.04,114.3 60.96,114.3
  pour Top (isolate 0.61): 24.13,13.97 21.59,16.51 21.59,20.32 17.78,27.94 17.78,30.48 24.13,35.56 21.59,38.1 21.59,52.07 24.13,57.15 21.59,59.69 21.59,73.66 24.13,78.74 21.59,81.28 21.59,95.25 24.13,100.33 21.59,102.87 21.59,111.76 17.78,121.92 19.05,124.46 24.13,123.19 58.42,105.41 60.96,105.41 63.5,107.95 72.39,107.95 78.74,100.33 82.55,100.33 86.36,95.25 91.44,92.71 99.06,92.71 104.14,82.55 105.41,76.2 107.95,73.66 111.76,72.39 109.22,74.93 109.22,78.74 111.76,81.28 101.6,92.71 101.6,100.33 105.41,107.95 93.98,114.3 92.71,114.3 95.25,111.76 92.71,109.22 90.17,109.22 86.36,111.76 86.36,123.19 85.09,123.19 77.47,116.84 76.2,115.57 43.18,115.57 29.21,123.19 19.05,127 16.51,124.46 16.51,118.11 19.05,113.03 19.05,82.55 20.32,74.93 20.32,54.61 19.05,50.8 19.05,36.83 16.51,29.21 16.51,26.67 19.05,21.59 19.05,17.78 21.59,13.97
N$1
  Bottom 0.813: U$2.AE2 10.16,16.51 15.24,16.51 E1.2
N$2
  Bottom 0.813: U$2.AF2 8.89,20.32 16.51,20.32 21.59,26.67 21.59,29.21 24.13,31.75 31.75,31.75 34.29,29.21 34.29,25.4 33.02,24.13 E1.12
N$3
  Bottom 0.813: U$2.AM2 8.89,35.56 15.24,35.56 20.32,41.91 22.86,46.99 E2.2
N$4
  Bottom 0.813: U$2.AN2 8.89,39.37 15.24,39.37 17.78,41.91 22.86,52.07 24.13,53.34 31.75,53.34 34.29,50.8 34.29,48.26 E2.12
N$5
  Bottom 0.813: U$2.AS2 8.89,48.26 16.51,48.26 20.32,52.07 21.59,54.61 21.59,55.88 21.59,67.31 E3.2
N$6
  Bottom 0.813: U$2.AT2 8.89,52.07 16.51,52.07 19.05,53.34 20.32,55.88 20.32,69.85 21.59,72.39 24.13,74.93 31.75,74.93 34.29,72.39 34.29,69.85 E3.12
N$7
  Bottom 0.813: U$2.BD2 8.89,83.82 15.24,83.82 19.05,86.36 E4.2
N$8
  Bottom 0.813: U$2.BE2 8.89,86.36 15.24,86.36 19.05,90.17 20.32,93.98 22.86,96.52 30.48,96.52 33.02,95.25 34.29,92.71 34.29,90.17 33.02,88.9 E4.12
N$9
  Bottom 0.813: U$2.BH2 8.89,92.71 15.24,92.71 20.32,99.06 21.59,110.49 E5.2
N$10
  Bottom 0.813: U$2.BJ2 8.89,96.52 15.24,96.52 19.05,101.6 20.32,111.76 22.86,116.84 24.13,118.11 31.75,118.11 34.29,115.57 34.29,113.03 E5.12
N$11
  Bottom 0.813: E5.8 35.56,97.79 36.83,95.25 38.1,90.17 D1.A
N$12
  Bottom 0.813: E5.6 34.29,96.52 35.56,93.98 36.83,85.09 D3.A
N$13
  Bottom 0.813: E4.8 36.83,74.93 D5.A
N$14
  Bottom 0.813: E4.6 30.48,77.47 34.29,74.93 36.83,71.12 36.83,67.31 D7.A
N$15
  Bottom 0.813: E3.8 D9.A
N$16
  Bottom 0.813: E3.6 30.48,55.88 34.29,53.34 36.83,50.8 D11.A
N$17
  Bottom 0.813: E2.8 D13.A
N$18
  Bottom 0.813: E2.6 30.48,34.29 38.1,30.48 D15.A
N$19
  Bottom 0.813: E1.8 33.02,13.97 35.56,16.51 35.56,17.78 38.1,21.59 D17.A
N$20
  Bottom 0.813: E1.6 30.48,11.43 35.56,11.43 D19.A
N$21
  Bottom 0.813: D19.C D20.A
N$22
  Bottom 0.813: D17.C D18.A
N$23
  Bottom 0.813: D15.C D16.A
N$24
  Bottom 0.813: D13.C D14.A
N$25
  Bottom 0.813: D11.C D12.A
N$26
  Bottom 0.813: D9.C D10.A
N$27
  Bottom 0.813: D7.C D8.A
N$28
  Bottom 0.813: D5.C D6.A
N$29
  Bottom 0.813: D3.C D4.A
N$30
  Bottom 0.813: D1.C D2.A
N$31
  Bottom 0.813: R11.2 58.42,13.97 D20.C 63.5,12.7 71.12,12.7 Q10.2
N$32
  Bottom 0.813: R10.2 58.42,21.59 D18.C 63.5,20.32 71.12,20.32 Q9.2
N$33
  Bottom 0.813: R9.2 58.42,30.48 D16.C 63.5,29.21 71.12,29.21 Q8.2
N$34
  Bottom 0.813: R8.2 58.42,38.1 D14.C 63.5,36.83 71.12,36.83 Q7.2
N$35
  Bottom 0.813: R7.2 59.69,45.72 D12.C 71.12,45.72 Q6.2
N$36
  Bottom 0.813: R6.2 58.42,54.61 D10.C 63.5,53.34 71.12,53.34 Q5.2
N$37
  Bottom 0.813: R5.2 59.69,62.23 D8.C 71.12,62.23 Q4.2
N$38
  Bottom 0.813: R4.2 58.42,71.12 D6.C 63.5,69.85 71.12,69.85 Q3.2
N$39
  Bottom 0.813: R3.2 58.42,80.01 D4.C 63.5,78.74 71.12,78.74 Q2.2
N$40
  Bottom 0.813: Q1.2 71.12,86.36 63.5,86.36 D2.C 58.42,87.63 R2.2
N$41
  Bottom 0.813: R61.1 R54.1 62.23,129.54 52.07,129.54 R55.2 C12.- 38.1,110.49 D32.A 38.1,97.79 39.37,96.52 R12.1 R2.1 R3.1 | R21.1 R11.1 R10.1 | R10.1 R20.1 | R9.1 R19.1 | R8.1 R18.1 | R7.1 R17.1 | R8.1 R7.1 | R9.1 R8.1 | R10.1 R9.1 | R5.1 R4.1 | R4.1 R3.1 | R7.1 R6.1 | R6.1 R5.1 | R3.1 R13.1 | R4.1 R14.1 | R5.1 R15.1 | R6.1 R16.1
N$42  (via drill 0.81)
  Top 0.813: v40.64,99.06 v43.18,101.6
  Bottom 0.813: Q23.2 45.72,101.6 v43.18,101.6 | Q26.6 R65.2 40.64,102.87 v40.64,99.06
N$43
  Bottom 0.813: Q26.4 Q26.3 66.04,127 R66.1
N$44
  Bottom 0.813: Q23.1 Q22.2 69.85,106.68 R59.1
N$45
  Top 0.813: R57.1 77.47,97.79 R56.2
  Bottom 0.813: Q26.5 55.88,124.46 59.69,121.92 62.23,121.92 66.04,120.65 69.85,116.84 72.39,110.49 73.66,107.95 73.66,104.14 R57.1
N$46
  Bottom 0.813: Q26.2 63.5,123.19 66.04,123.19 R67.2 D33.A
N$51
  Bottom 0.813: Q1.3 72.39,90.17 69.85,87.63 64.77,87.63 62.23,90.17 C1.1 55.88,92.71 R22.1 R12.2
N$52
  Bottom 0.813: R13.2 R23.1 55.88,85.09 C2.1 62.23,82.55 64.77,80.01 69.85,80.01 72.39,82.55 Q2.3
N$53
  Bottom 0.813: R14.2 R24.1 55.88,76.2 C3.1 62.23,73.66 64.77,71.12 69.85,71.12 72.39,73.66 Q3.3
N$54
  Bottom 0.813: R15.2 R25.1 55.88,68.58 C4.1 62.23,66.04 64.77,63.5 69.85,63.5 72.39,66.04 Q4.3
N$55
  Bottom 0.813: R17.2 R27.1 55.88,52.07 C6.1 62.23,49.53 64.77,46.99 69.85,46.99 72.39,49.53 Q6.3
N$56
  Bottom 0.813: R18.2 R28.1 55.88,43.18 C7.1 62.23,40.64 64.77,38.1 69.85,38.1 72.39,40.64 Q7.3
N$57
  Bottom 0.813: R19.2 R29.1 55.88,35.56 C8.1 62.23,33.02 64.77,30.48 69.85,30.48 72.39,33.02 Q8.3
N$58
  Bottom 0.813: R20.2 R30.1 55.88,26.67 C9.1 62.23,24.13 64.77,21.59 69.85,21.59 72.39,24.13 Q9.3
N$59
  Bottom 0.813: R21.2 R31.1 55.88,19.05 C10.1 62.23,16.51 64.77,13.97 69.85,13.97 72.39,16.51 Q10.3
N$60
  Bottom 0.813: R16.2 R26.1 55.88,59.69 C5.1 62.23,57.15 64.77,54.61 69.85,54.61 72.39,57.15 Q5.3
N$61
  Bottom 0.813: R30.2 C9.2 68.58,26.67 Q19.2 85.09,26.67 91.44,22.86 D29.C
N$62
  Top 0.813: Q11.2 68.58,92.71 C1.2
  Bottom 0.813: R22.2 C1.2 | Q11.2 87.63,92.71 D21.C
N$63
  Bottom 0.813: R23.2 C2.2 68.58,85.09 Q12.2 85.09,85.09 92.71,81.28 D22.C
N$64
  Bottom 0.813: R24.2 C3.2 68.58,76.2 Q13.2 87.63,76.2 92.71,72.39 D23.C
N$65
  Bottom 0.813: R25.2 C4.2 68.58,68.58 Q14.2 85.09,68.58 92.71,63.5 D24.C
N$66
  Bottom 0.813: R26.2 C5.2 68.58,59.69 Q15.2 86.36,59.69 92.71,55.88 D25.C
N$67
  Bottom 0.813: R27.2 C6.2 68.58,52.07 Q16.2 86.36,52.07 92.71,46.99 D26.C
N$68
  Bottom 0.813: R28.2 C7.2 68.58,43.18 Q17.2 86.36,43.18 91.44,39.37 D27.C
N$69
  Bottom 0.813: R29.2 C8.2 68.58,35.56 Q18.2 85.09,35.56 91.44,30.48 D28.C
N$70
  Bottom 0.813: R31.2 C10.2 69.85,19.05 Q20.2 85.09,19.05 92.71,16.51 D30.C
N$71
  Bottom 0.813: Q20.3 86.36,12.7 R50.1
N$72
  Bottom 0.813: Q19.3 86.36,20.32 R49.1 100.33,20.32 101.6,19.05 R48.1
N$73
  Bottom 0.813: Q18.3 86.36,27.94 88.9,26.67 R47.1 100.33,26.67 101.6,25.4 R46.1
N$74
  Bottom 0.813: Q17.3 R45.1 100.33,34.29 101.6,33.02 R44.1
N$75
  Bottom 0.813: Q11.3 83.82,87.63 R33.1 93.98,85.09 99.06,83.82 R32.1
N$76
  Bottom 0.813: Q12.3 R35.1 95.25,76.2 R34.1
N$77
  Bottom 0.813: Q13.3 R37.1 95.25,67.31 R36.1
N$78
  Bottom 0.813: R38.1 97.79,59.69 R39.1 87.63,60.96 Q14.3
N$79
  Bottom 0.813: R40.1 96.52,50.8 R41.1 Q15.3
N$80
  Bottom 0.813: R42.1 97.79,41.91 R43.1 Q16.3
N$81
  Bottom 0.813: R64.1 105.41,114.3 107.95,119.38 Q25.3
N$82
  Bottom 0.813: Q21.1 111.76,104.14 | 111.76,104.14 R53.1 | 111.76,104.14 113.03,107.95 114.3,110.49 114.3,115.57 Q25.2 113.03,119.38 113.03,124.46 110.49,127 C16.1
N$83
  Top 0.813: Q21.2 114.3,107.95 116.84,106.68 116.84,90.17 R33.2
  Bottom 0.813: R60.1 C14.1 96.52,100.33 102.87,92.71 R33.2 109.22,82.55 109.22,78.74 R35.2 106.68,71.12 R37.2 R39.2 R41.2 R43.2 R45.2 R47.2 R49.2 R50.2
N$84
  Bottom 0.813: C14.2 99.06,114.3 R63.2 R61.2 107.95,124.46 110.49,124.46 111.76,123.19 111.76,120.65 109.22,118.11 Q25.1
N$85
  Top 0.813: R54.2 106.68,120.65 Q21.4
  Bottom 0.813: Q21.4 Q21.3
N$86
  Top 0.813: R62.2 100.33,116.84 C16.2
OUTPUT
  Bottom 0.813: R60.2 96.52,114.3 R63.1 95.25,119.38 96.52,120.65 96.52,124.46 93.98,127 64.77,130.81 46.99,130.81 40.64,128.27 27.94,121.92 24.13,121.92 17.78,118.11 8.89,118.11 U$2.BS2
VCC  (via drill 0.81)
  Top 0.813: v26.67,5.08 29.21,7.62 29.21,26.67 E1.14 29.21,31.75 29.21,48.26 E2.14 29.21,53.34 29.21,69.85 E3.14 29.21,74.93 29.21,91.44 E4.14 29.21,96.52 29.21,113.03 E5.14
  Bottom 0.813: U$2.AA2 8.26,3.81 21.59,3.81 v26.67,5.08 57.15,3.81 73.66,3.81 100.33,5.08 109.22,6.35 114.3,8.89 116.84,11.43 116.84,86.36 C15.+ R53.2 | R53.2 Q21.6 | R64.2 92.71,109.22 97.79,101.6 100.33,100.33 R53.2

### Text on the board
Bottom: 10 BIT D-A CONVERTER | A607B